# EAGLE design Power Board CRoach (EAGLE 7.1.0)
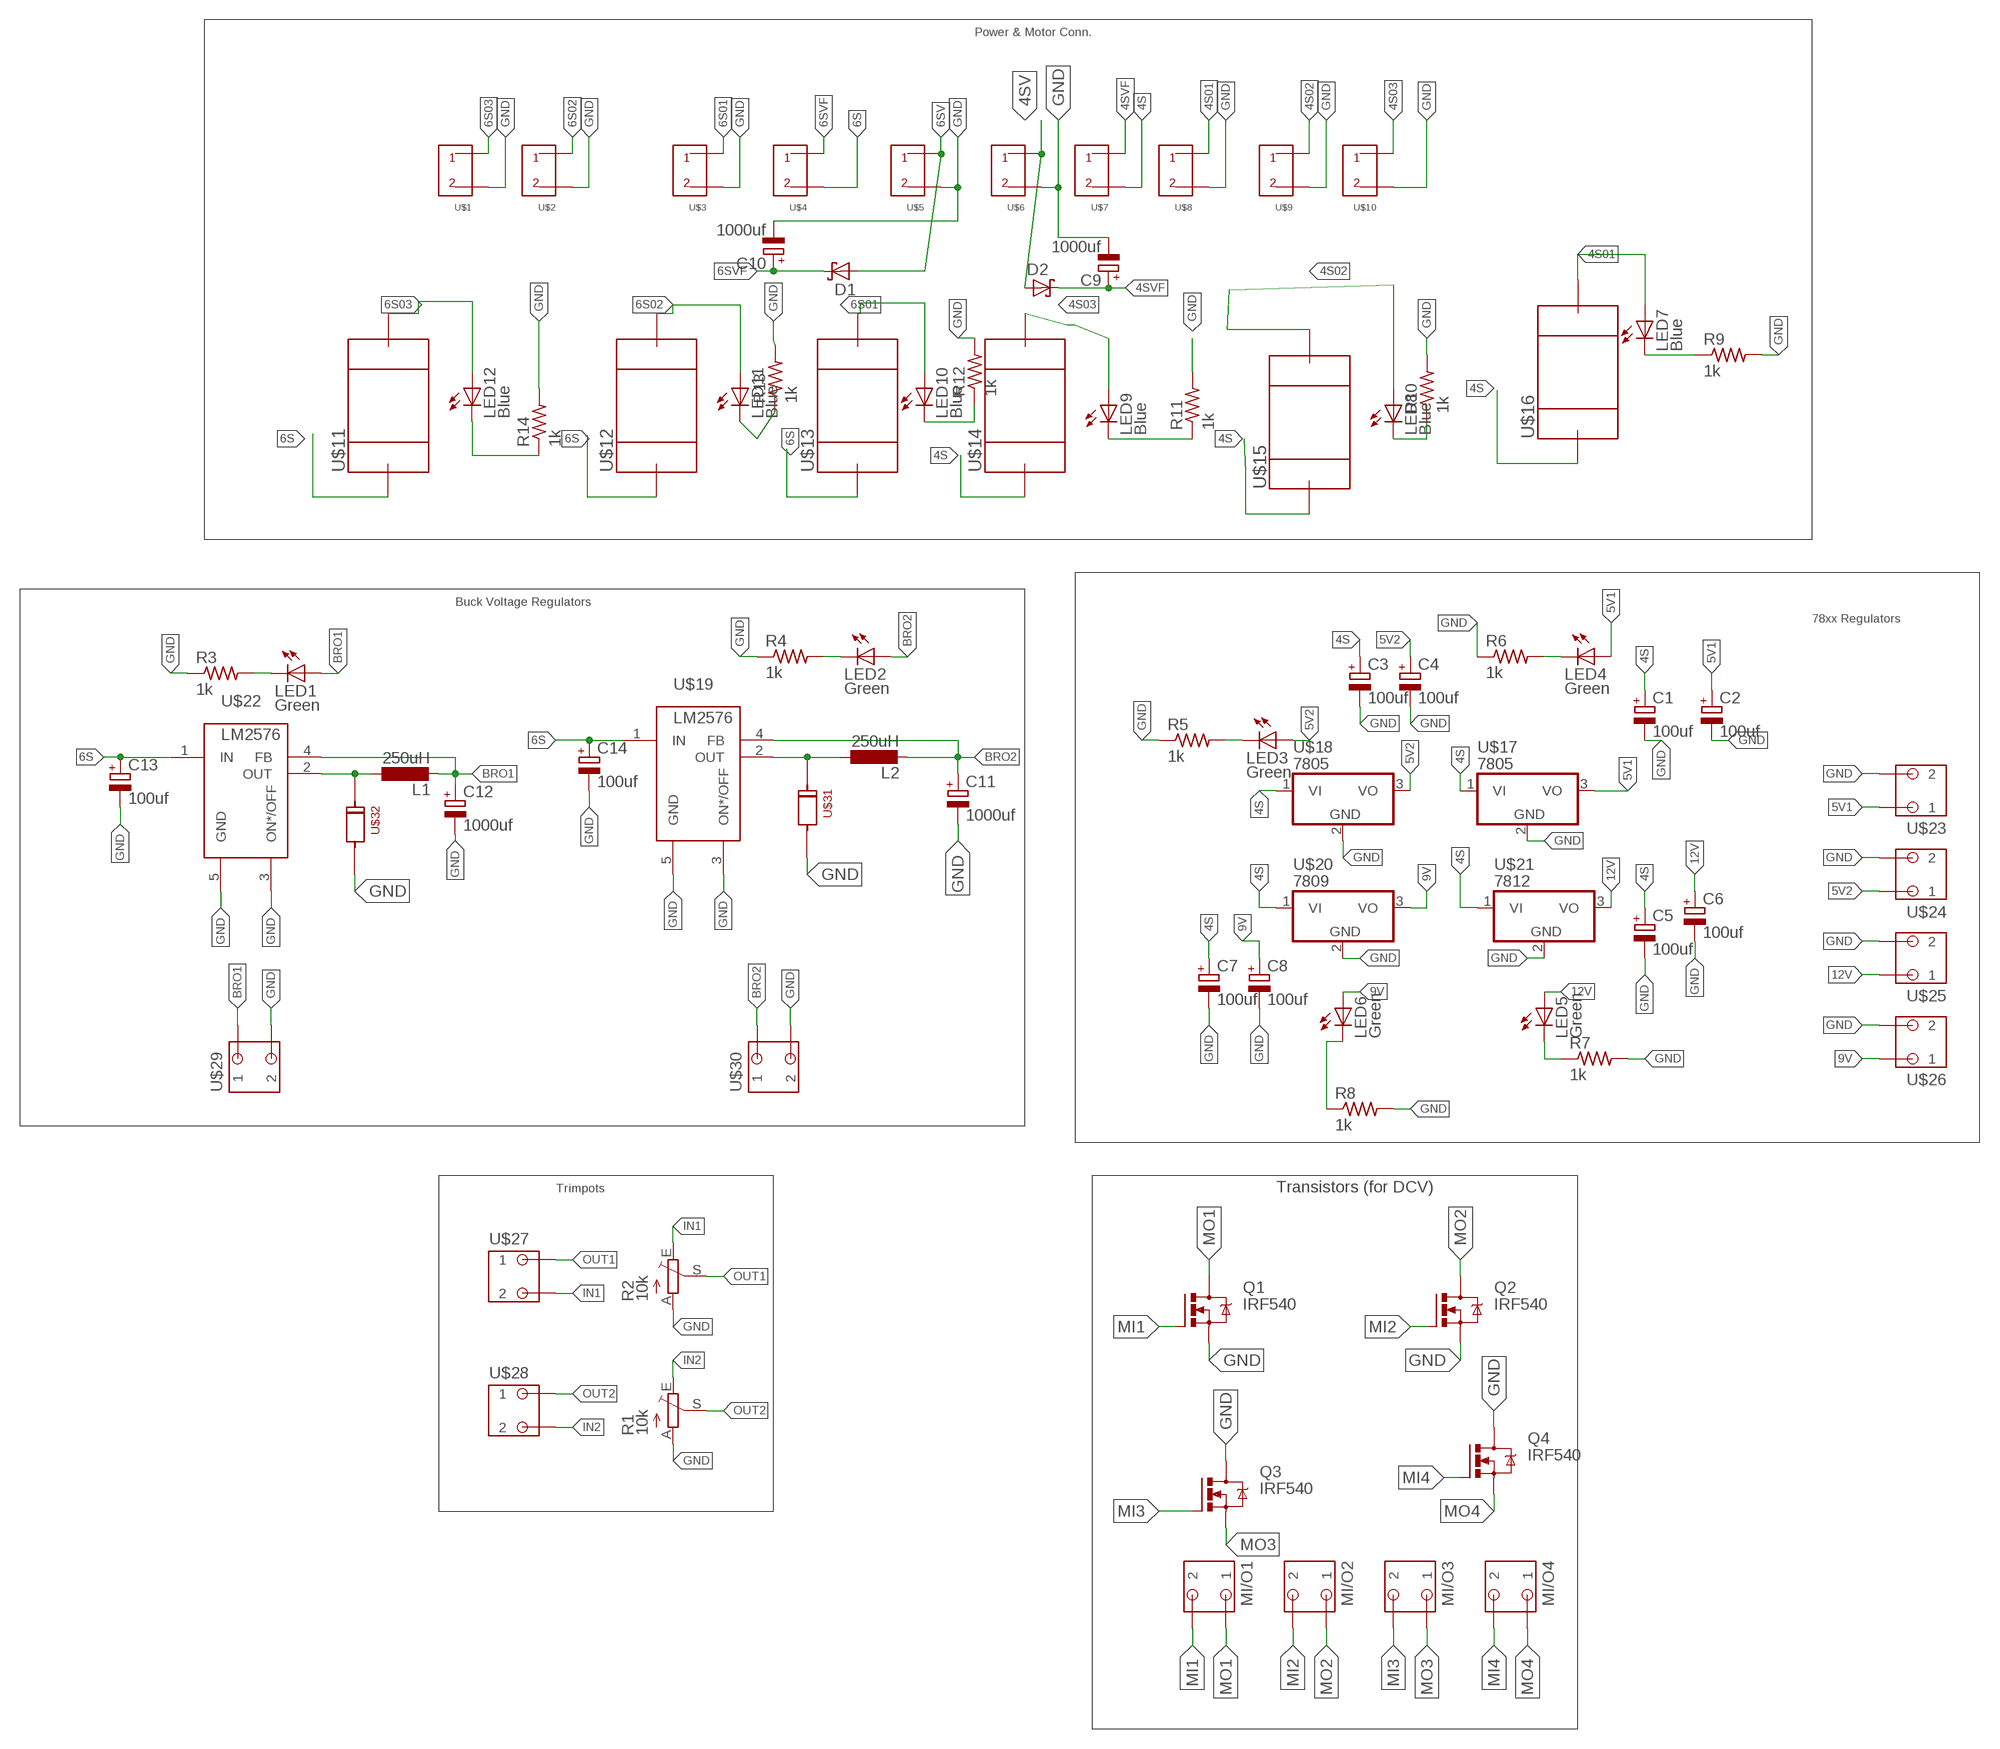
[diagram p0: schematic, sheet 1]

## Parts
C1  100uf  CPOL-EUE2-5  [E2-5]
C2  100uf  CPOL-EUE2-5  [E2-5]
C3  100uf  CPOL-EUE2-5  [E2-5]
C4  100uf  CPOL-EUE2-5  [E2-5]
C5  100uf  CPOL-EUE2-5  [E2-5]
C6  100uf  CPOL-EUE2-5  [E2-5]
C7  100uf  CPOL-EUE2-5  [E2-5]
C8  100uf  CPOL-EUE2-5  [E2-5]
C9  1000uf  CPOL-EUE7.5-16  [E7,5-16]
C10  1000uf  CPOL-EUE7.5-16  [E7,5-16]
C11  1000uf  CPOL-EUE7.5-16  [E7,5-16]
C12  1000uf  CPOL-EUE7.5-16  [E7,5-16]
C13  100uf  CPOL-EUE2.5-5  [E2,5-5]
C14  100uf  CPOL-EUE2.5-5  [E2,5-5]
D1  SCHOTTKY-DIODEP6T15  [P6T15]
D2  SCHOTTKY-DIODEP6T15  [P6T15]
L1  250uH  L-EU0204/7  [0204/7]
L2  250uH  L-EU0204/7  [0204/7]
LED1  Green  LED5MM  [LED5MM]
LED2  Green  LED5MM  [LED5MM]
LED3  Green  LED5MM  [LED5MM]
LED4  Green  LED5MM  [LED5MM]
LED5  Green  LED5MM  [LED5MM]
LED6  Green  LED5MM  [LED5MM]
LED7  Blue  LED5MM  [LED5MM]
LED8  Blue  LED5MM  [LED5MM]
LED9  Blue  LED5MM  [LED5MM]
LED10  Blue  LED5MM  [LED5MM]
LED11  Blue  LED5MM  [LED5MM]
LED12  Blue  LED5MM  [LED5MM]
MI/O1  SPTBB2-A2  [SPTB]
MI/O2  SPTBB2-A2  [SPTB]
MI/O3  SPTBB2-A2  [SPTB]
MI/O4  SPTBB2-A2  [SPTB]
Q1  IRF540  [TO220BV]
Q2  IRF540  [TO220BV]
Q3  IRF540  [TO220BV]
Q4  IRF540  [TO220BV]
R1  10k  TRIM_EU-CA6V  [CA6V]
R2  10k  TRIM_EU-CA6V  [CA6V]
R3  1k  R-US_0204/7  [0204/7]
R4  1k  R-US_0204/7  [0204/7]
R5  1k  R-US_0204/7  [0204/7]
R6  1k  R-US_0204/7  [0204/7]
R7  1k  R-US_0204/7  [0204/7]
R8  1k  R-US_0204/7  [0204/7]
R9  1k  R-US_0204/7  [0204/7]
R10  1k  R-US_0204/7  [0204/7]
R11  1k  R-US_0204/7  [0204/7]
R12  1k  R-US_0204/7  [0204/7]
R13  1k  R-US_0204/7  [0204/7]
R14  1k  R-US_0204/7  [0204/7]
U$1  SCREW_XT-60  [SCREW_XT-60]
U$2  SCREW_XT-60  [SCREW_XT-60]
U$3  SCREW_XT-60  [SCREW_XT-60]
U$4  SCREW_XT-60  [SCREW_XT-60]
U$5  SCREW_XT-60  [SCREW_XT-60]
U$6  SCREW_XT-60  [SCREW_XT-60]
U$7  SCREW_XT-60  [SCREW_XT-60]
U$8  SCREW_XT-60  [SCREW_XT-60]
U$9  SCREW_XT-60  [SCREW_XT-60]
U$10  SCREW_XT-60  [SCREW_XT-60]
U$11  CPT-FUSE  [CPT-FUSES]
U$12  CPT-FUSE  [CPT-FUSES]
U$13  CPT-FUSE  [CPT-FUSES]
U$14  CPT-FUSE  [CPT-FUSES]
U$15  CPT-FUSE  [CPT-FUSES]
U$16  CPT-FUSE  [CPT-FUSES]
U$17  7805  [78XX]
U$18  7805  [78XX]
U$19  LM2576  [LM2576]
U$20  7809  [78XX]
U$21  7812  [78XX]
U$22  LM2576  [LM2576]
U$23  SPTBB2-A1  [SPTB]
U$24  SPTBB2-A1  [SPTB]
U$25  SPTBA2-B1  [SPTB]
U$26  SPTBA2-B1  [SPTB]
U$27  SPTBB2-A1  [SPTB]
U$28  SPTBB2-A1  [SPTB]
U$29  SPTBA2-B1  [SPTB]
U$30  SPTBA2-B1  [SPTB]
U$31  1N5822  [1N5822]
U$32  1N5822  [1N5822]

## Nets
4S: C1.+ C3.+ C5.+ C7.+ U$7.P$2 U$14.P$1 U$15.P$1 U$16.P$1 U$17.1(VI) U$18.1(VI) U$20.1(VI) U$21.1(VI)
4S01: LED7.A U$8.P$1 U$16.P$2
4S02: LED8.A U$9.P$1 U$15.P$2
4S03: LED9.A U$10.P$1 U$14.P$2
4SV: D2.A U$6.P$1
4SVF: C9.+ D2.C U$7.P$1
5V1: C2.+ LED4.A U$17.3(VO) U$23.B2
5V2: C4.+ LED3.A U$18.3(VO) U$24.B2
6S: C13.+ C14.+ U$4.P$2 U$11.P$1 U$12.P$1 U$13.P$1 U$19.1(IN) U$22.1(IN)
6S01: LED10.A U$3.P$1 U$13.P$2
6S02: LED11.A U$2.P$1 U$12.P$2
6S03: LED12.A U$1.P$1 U$11.P$2
6SV: D1.A U$5.P$1
6SVF: C10.+ D1.C U$4.P$1
9V: C8.+ LED6.A U$20.3(VO) U$26.A2
12V: C6.+ LED5.A U$21.3(VO) U$25.A2
BRO1: C12.+ L1.2 LED1.A U$22.4(FB) U$29.A2
BRO2: C11.+ L2.2 LED2.A U$19.4(FB) U$30.A2
GND: C1.- C2.- C3.- C4.- C5.- C6.- C7.- C8.- C9.- C10.- C11.- C12.- C13.- C14.- Q1.S Q2.S Q3.D Q4.D R1.A R2.A R3.1 R4.1 R5.1 R6.1 R7.2 R8.2 R9.2 R10.2 R11.2 R12.2 R13.2 R14.2 U$1.P$2 U$2.P$2 U$3.P$2 U$5.P$2 U$6.P$2 U$8.P$2 U$9.P$2 U$10.P$2 U$17.2(GND) U$18.2(GND) U$19.3(ON*/OFF) U$19.5(GND) U$20.2(GND) U$21.2(GND) U$22.3(ON*/OFF) U$22.5(GND) U$23.A1 U$24.A1 U$25.B1 U$26.B1 U$29.B1 U$30.B1 U$31.- U$32.-
IN1: R2.E U$27.A1
IN2: R1.E U$28.A1
MI1: MI/O1.A2 Q1.G
MI2: MI/O2.A2 Q2.G
MI3: MI/O3.A2 Q3.G
MI4: MI/O4.A2 Q4.G
MO1: MI/O1.B2 Q1.D
MO2: MI/O2.B2 Q2.D
MO3: MI/O3.B2 Q3.S
MO4: MI/O4.B2 Q4.S
N$1: LED7.K(C) R9.1
N$2: LED8.K(C) R10.1
N$3: LED9.K(C) R11.1
N$4: LED10.K(C) R12.1
N$5: LED11.K(C) R13.1
N$6: LED12.K(C) R14.1
N$8: L1.1 U$22.2(OUT) U$32.+
N$11: L2.1 U$19.2(OUT) U$31.+
N$24: LED5.K(C) R7.1
N$25: LED6.K(C) R8.1
N$31: LED3.K(C) R5.2
N$32: LED4.K(C) R6.2
N$41: LED2.K(C) R4.2
N$42: LED1.K(C) R3.2
OUT1: R2.S U$27.B2
OUT2: R1.S U$28.B2

## Notes on the sheet
- Power & Motor Conn.
- Buck Voltage Regulators
- 78xx Regulators
- Trimpots | Transistors (for DCV)

## Library data of the parts
C1-C14 = rcl:CPOL-EU: POLARIZED CAPACITOR, European symbol
D1 D2 = diode:SCHOTTKY-DIODE: Schottky Diode
L1 L2 = rcl:L-EU: INDUCTOR, European symbol
LED1-LED12 = led:LED: LED OSRAM: - CHIPLED LG R971, LG N971, LY N971, LG Q971, LY Q971, LO R971, LY R971 LH N974, LH R974 LS Q976, LO Q976, LY Q976 LO Q996 - Hyper CHIPLED LW Q18S LB Q993, LB Q99A, LB R99A - SideLED LS A670, LO A670, LY A670, LG A670, LP A670 LB A673, LV A673, LT A673, LW A673 LH A674 LY A675 LS A676, LA A676, LO A676, LY A676, LW A676 LS A679, LY A679, LG A679 - Hyper Micro SIDELED® LS Y876, LA Y876, LO Y876, LY Y876 LT Y87S - SmartLED LW L88C, LW L88S LB L89C, LB L89S, LG L890 LS L89K, LO L89K, LY L89K LS L896, LA L896, LO L896, LY L896 - TOPLED LS T670, LO T670, LY T670, LG T670, LP T670 LSG T670, LSP T670, LSY T670, LOP T670, LYG T670 LG T671, LOG T671, LSG T671 LB T673, LV T673, LT T673, LW T673 LH T674 LS T676, LA T676, LO T676, LY T676, LB T676, LH T676, LSB T676, LW T676 LB T67C, LV T67C, LT T67C, LS T67K, LO T67K, LY T67K, LW E67C LS E67B, LA E67B, LO E67B, LY E67B, LB E67C, LV E67C, LT E67C LW T67C LS T679, LY T679, LG T679 LS T770, LO T770, LY T770, LG T770, LP T770 LB T773, LV T773, LT T773, LW T773 LH T774 LS E675, LA E675, LY E675, LS T675 LS T776, LA T776, LO T776, LY T776, LB T776 LHGB T686 LT T68C, LB T68C - Hyper Mini TOPLED® LB M676 - Mini TOPLED Santana® LG M470 LS M47K, LO M47K, LY M47K Source: http://www.osram.convergy.de LUXEON: - LUMILED® LXK2-PW12-R00, LXK2-PW12-S00, LXK2-PW14-U00, LXK2-PW14-V00 LXK2-PM12-R00, LXK2-PM12-S00, LXK2-PM14-U00 LXK2-PE12-Q00, LXK2-PE12-R00, LXK2-PE12-S00, LXK2-PE14-T00, LXK2-PE14-U00 LXK2-PB12-K00, LXK2-PB12-L00, LXK2-PB12-M00, LXK2-PB14-N00, LXK2-PB14-P00, LXK2-PB14-Q00 LXK2-PR12-L00, LXK2-PR12-M00, LXK2-PR14-Q00, LXK2-PR14-R00 LXK2-PD12-Q00, LXK2-PD12-R00, LXK2-PD12-S00 LXK2-PH12-R00, LXK2-PH12-S00 LXK2-PL12-P00, LXK2-PL12-Q00, LXK2-PL12-R00 Source: www.luxeon.com KINGBRIGHT: KA-3528ASYC Source: www.kingbright.com
MI/O1-MI/O4 U$23-U$30 = #rcn-15:SPTB
Q1-Q4 = transistor-power:IRF540: HEXFET Power MOSFET
R1 R2 = pot:TRIM_EU-: POTENTIOMETER
R3-R14 = rcl:R-US_: RESISTOR, American symbol
U$1-U$10 = #rcn-15:SCREW_XT-60
U$11-U$16 = #rcn-15:CPT-FUSE
U$17 U$18 U$20 U$21 = #rcn-15:78*: Positive VOLTAGE REGULATOR Source: http://cache.national.com/ds/LM/LM78L05.pdf http://www.fairchildsemi.com/ds/LM/LM7805.pdf
U$19 U$22 = LM2576:LM2576: LM2576 - 5V switching regulator
U$31 U$32 = #rcn-15:1N5822

## Board
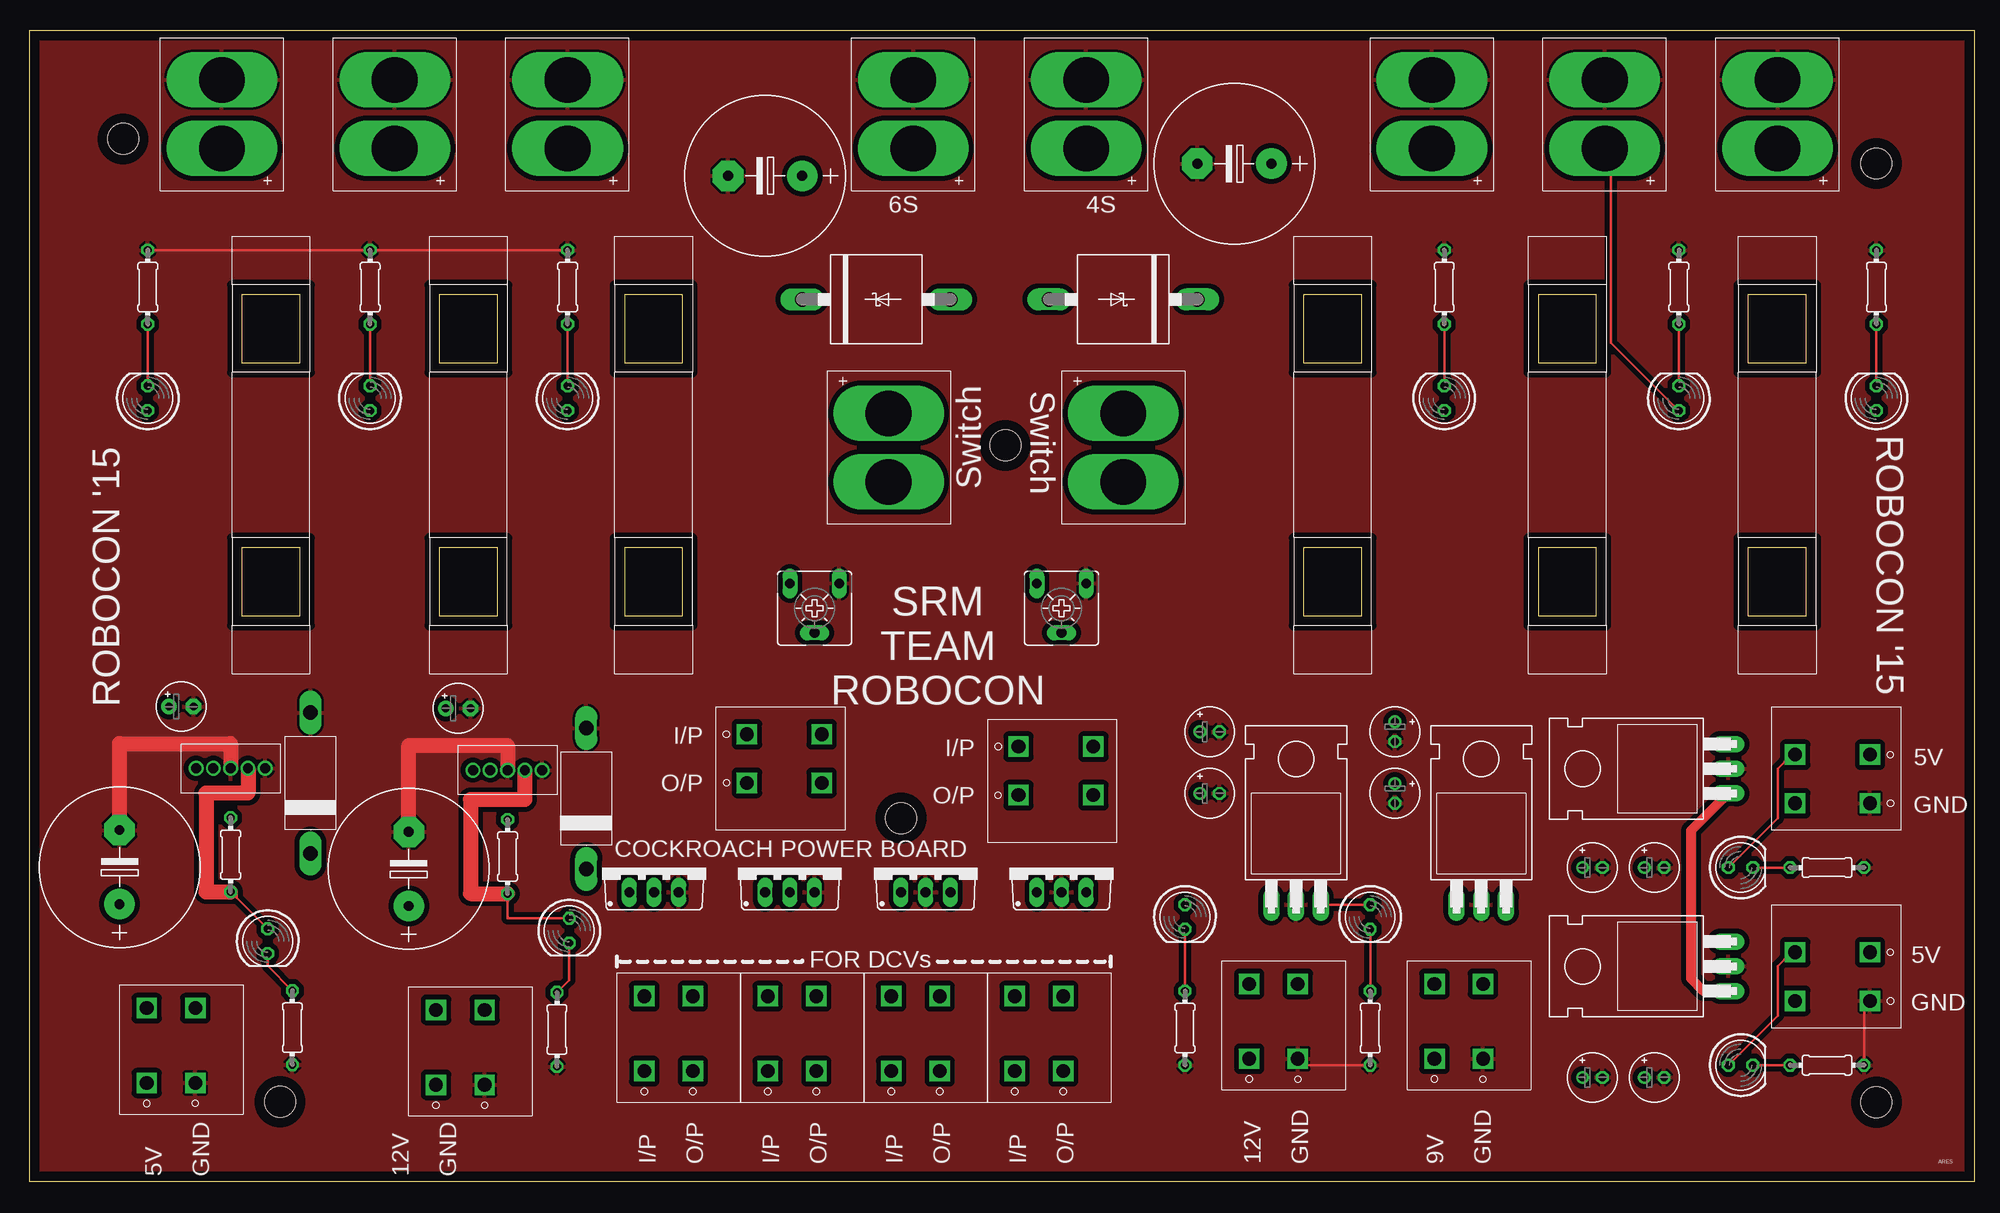
[diagram p1: board, top side]
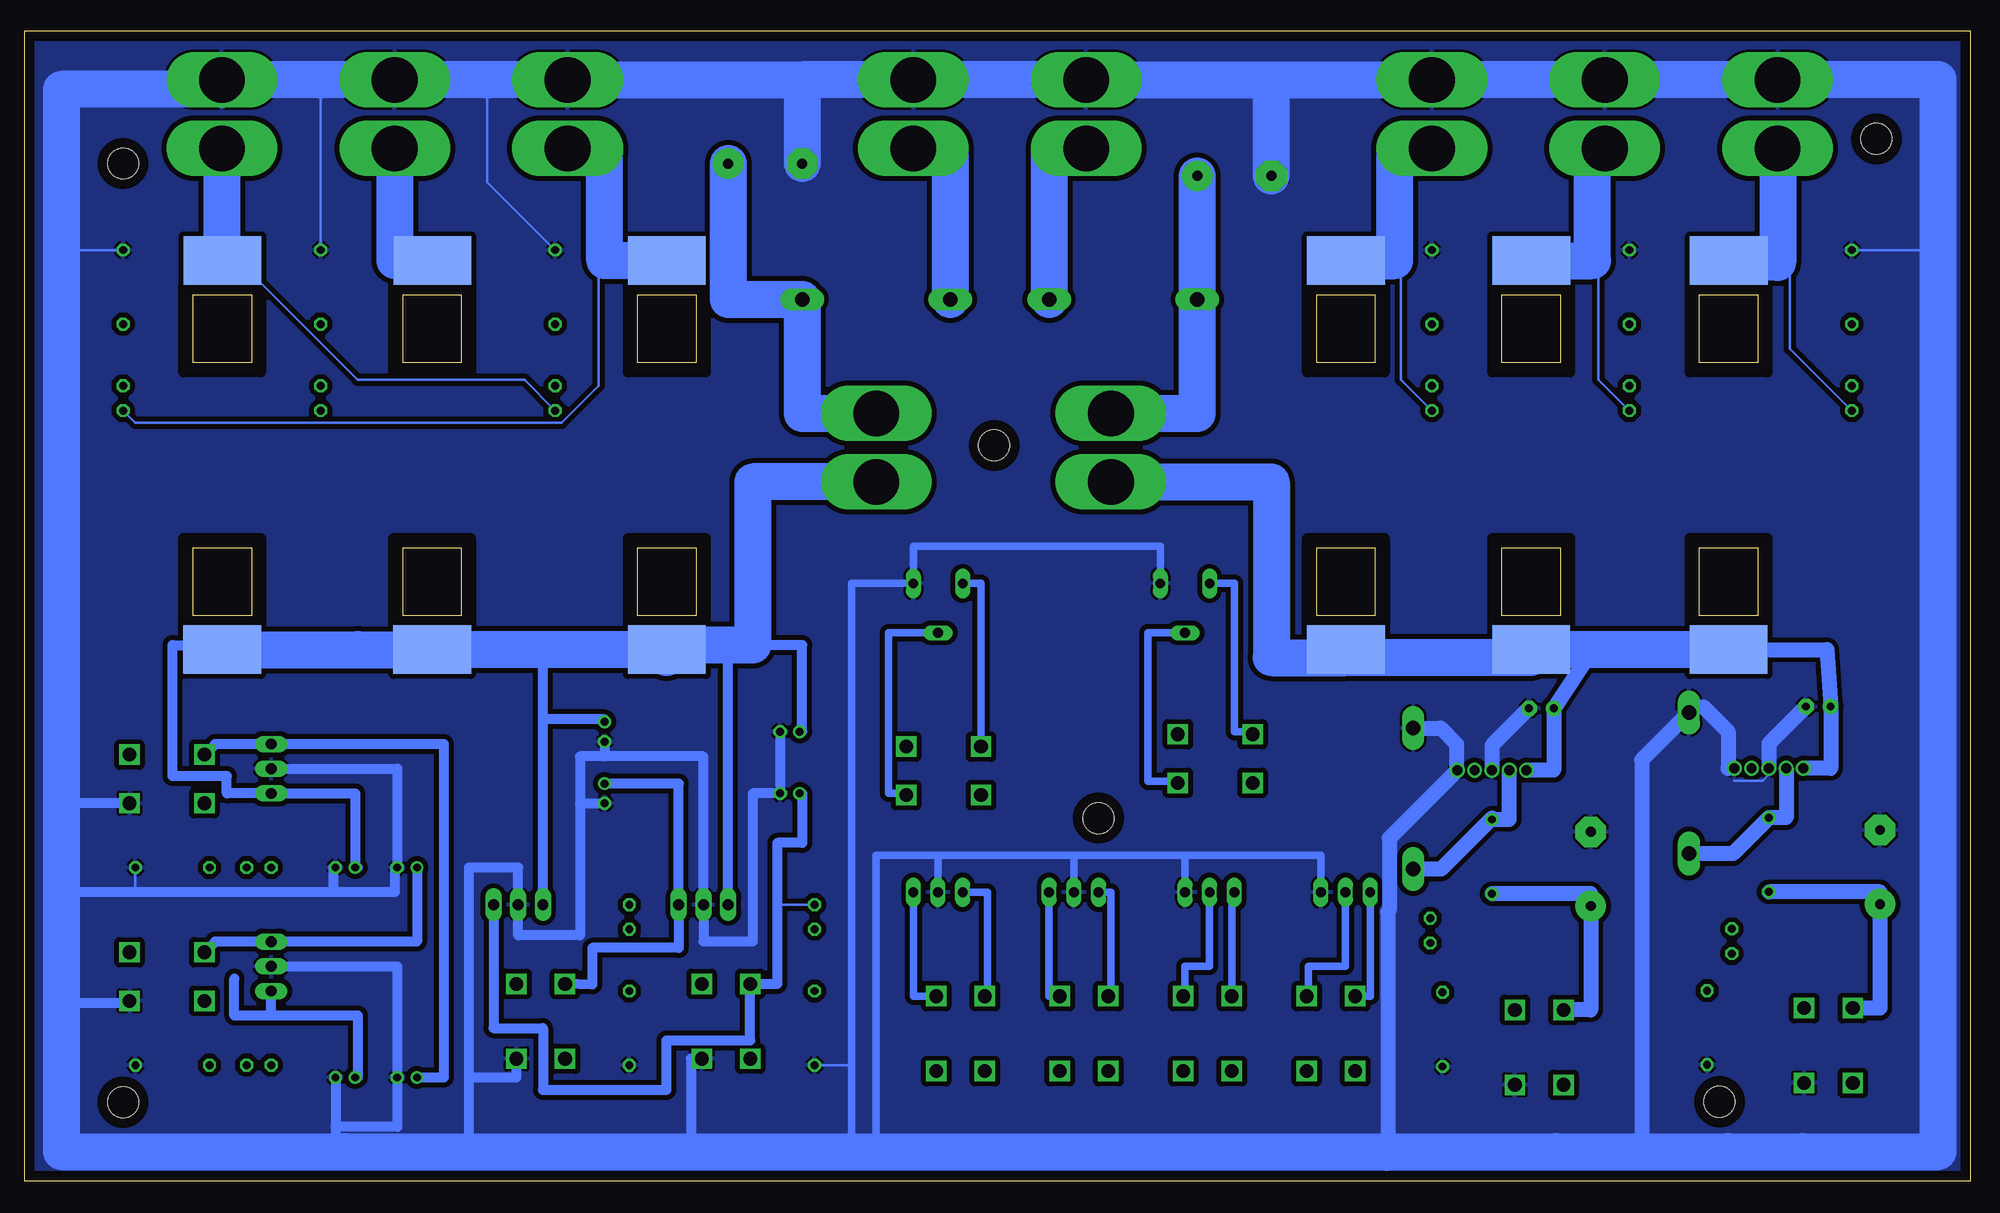
[diagram p2: board, bottom side, seen from below]

Size 200.13 x 118.29 mm. Coordinates in mm from the lower left corner, seen from the top.
Outline: 0,0 200.13,0 200.13,118.29 0,118.29 0,0
Copper layers (1*16): Top 0.035mm / dielectric 1.5mm / Bottom 0.035mm
Design rules "default *": minimum track width 10mil, minimum drill 24mil, track to track 10mil, track to pad 10mil, pad to pad 8mil, via to via 8mil, smd to smd 8mil, copper to edge 40mil, drill to drill 8mil, minimum pad ring 10mil, minimum via ring 8mil, stop-mask expansion 4mil, vias tented up to drill 0mil, thermal gap 10mil
Holes 3.17 mm at 9.65,107.19 25.8,8.17 89.66,37.34 100.4,75.67 189.99,104.65 189.99,8.13

### Footprints (pad centres in the part's own frame; a part is rotated, then mirrored left to right if it is on the bottom)
E2-5 = drill 0.813 pad 1.27: + -1.016,0 | drill 0.813 pad 1.27 octagon: - 1.016,0
E7,5-16 = drill 1.016 pad 3.15: + -3.81,0 | drill 1.016 pad 3.15 octagon: - 3.81,0
E2,5-5 = drill 0.813 pad 1.6: + -1.27,0 | drill 0.813 pad 1.6 octagon: - 1.27,0
P6T15 = drill 1.499 long: A 7.62,0; C -7.62,0
0204/7 = drill 0.813 octagon: 1 -3.81,0; 2 3.81,0
LED5MM = drill 0.813 octagon: A -1.27,0; K 1.27,0
SPTB = drill 1.4 square: A1 -2.28,-3.15; A2 -2.28,4.55; B1 2.72,-3.15; B2 2.72,4.55
TO220BV = drill 1.016 long: D 0,-2.54; G -2.54,-2.54; S 2.54,-2.54
CA6V = drill 1.016 long: A -2.54,-2.54; E 2.54,-2.54; S 0,2.54
SCREW_XT-60 = drill 4.699 long: P$1 -3.524,0; P$2 3.524,0
CPT-FUSES = smd 5 x 8 bottom: P$1 -19.492,0.039; P$2 20.502,0.055
78XX = drill 1.118 long: 1 -2.54,-8.89; 2 0,-8.89; 3 2.54,-8.89
LM2576 = drill 1.016: 1 -3.556,0; 2 -1.778,0; 3 0,0; 4 1.778,0; 5 3.556,0
1N5822 = drill 1.5 long: + -7,0; - 7.5,0

### Placement (x,y rotation side)
C1  167.13,10.67 0 top
C2  160.78,10.67 0 top
C3  167.13,32.26 0 top
C4  160.78,32.26 0 top
C5  140.46,46.23 270 top
C6  140.46,39.88 270 top
C7  121.41,46.23 0 top
C8  121.41,39.88 0 top
C9  123.95,104.65 180 top
C10  75.69,103.38 180 top
C11  39.04,32.12 90 top
C12  9.29,32.3 90 top
C13  15.64,48.81 0 top
C14  44.12,48.63 0 top
D1  87.12,90.68 0 top
D2  112.52,90.68 180 top
L1  20.72,33.57 270 top
L2  49.2,33.39 270 top
LED1  24.53,24.68 270 top
LED2  55.55,25.77 270 top
LED3  176.02,11.94 0 top
LED4  176.02,32.26 0 top
LED5  137.92,27.18 270 top
LED6  118.87,27.18 270 top
LED7  189.99,80.52 90 top
LED8  169.67,80.52 90 top
LED9  145.54,80.52 90 top
LED10  55.37,80.52 90 top
LED11  35.05,80.52 90 top
LED12  12.19,80.52 90 top
MI/O1  65.53,14.48 0 top
MI/O2  78.23,14.48 0 top
MI/O3  90.93,14.48 0 top
MI/O4  103.63,14.48 0 top
Q1  64.26,32.26 0 top
Q2  78.23,32.26 0 top
Q3  92.2,32.26 0 top
Q4  106.17,32.26 0 top
R1  80.77,58.93 180 top
R2  106.17,58.93 180 top
R3  27.07,15.79 90 top
R4  54.28,15.61 90 top
R5  184.91,11.94 180 top
R6  184.91,32.26 180 top
R7  137.92,15.75 270 top
R8  118.87,15.75 270 top
R9  189.99,91.95 90 top
R10  169.67,91.95 90 top
R11  145.54,91.95 90 top
R12  55.37,91.95 90 top
R13  35.05,91.95 90 top
R14  12.19,91.95 90 top
U$1  19.81,109.73 90 top
U$2  37.59,109.73 90 top
U$3  55.37,109.73 90 top
U$4  88.39,75.44 270 top
U$5  90.93,109.73 90 top
U$6  108.71,109.73 90 top
U$7  112.52,75.44 270 top
U$8  144.27,109.73 90 top
U$9  162.05,109.73 90 top
U$10  179.83,109.73 90 top
U$11  24.89,74.17 90 top
U$12  45.21,74.17 90 top
U$13  64.26,74.17 90 top
U$14  179.83,74.17 90 top
U$15  158.24,74.17 90 top
U$16  134.11,74.17 90 top
U$17  165.86,42.42 90 top
U$18  165.86,22.1 90 top
U$19  49.2,42.28 0 top
U$20  149.35,37.34 0 top
U$21  130.3,37.34 0 top
U$22  20.72,42.46 0 top
U$23  186.18,41.15 90 top
U$24  186.18,20.83 90 top
U$25  146.81,15.75 0 top
U$26  127.76,15.75 0 top
U$27  104.9,42.42 270 top
U$28  76.96,43.69 270 top
U$29  14.37,13.25 0 top
U$30  44.12,13.07 0 top
U$31  57.28,39.09 90 top
U$32  28.93,40.69 90 top

### Tracks (layer width: path | path; a pad name or v marks a point on that pad's centre or on a via)
4S
  Top 1.016: U$18.1 172.21,19.56 170.94,20.83 170.94,36.07 U$17.1
  Bottom 1.016: C1.+ 165.86,10.67 165.86,17.02 174.75,17.02 | 166.12,54.68 165.86,54.68 | U$20.1 146.81,47.5 | 146.81,47.5 146.81,54.68 | C5.+ 140.46,47.5 146.81,47.5 | U$21.1 127.76,55.12 | 165.86,32.26 C3.+ 166.12,39.88 U$17.1 179.32,39.88 179.32,41.66 184.91,41.66 184.91,55.12 179.79,55.12 U$14.P$1 | 174.75,17.02 178.56,17.02 178.56,20.83 | C7.+ 120.14,46.23 120.14,55.12 125.22,55.12 | 174.75,17.02 U$18.1
  Bottom 3.81: U$14.P$1 165.86,54.68 U$15.P$1 146.81,54.68 U$16.P$1 134.07,53.85 134.11,53.85 134.11,55.12 127.76,55.12 125.22,55.12 125.22,71.91 U$7.P$2
4S01
  Bottom 0.254: LED7.A 188.72,77.98 144.91,77.98 141.1,81.79 141.1,93.22 140.46,94.67
  Bottom 3.81: U$16.P$2 140.46,94.67 140.46,105.92 144.27,105.92 U$8.P$1
4S02
  Top 0.254: LED8.A 162.69,86.23 162.69,105.28 162.05,105.92 U$9.P$1
  Bottom 3.81: U$9.P$1 162.05,94.67 U$15.P$2
4S03
  Bottom 0.254: LED9.A 148.72,82.42 165.86,82.42 177.93,94.49 U$14.P$2
  Bottom 3.81: U$10.P$1 179.83,94.67 U$14.P$2
4SV
  Bottom 3.81: D2.A 104.9,106.2 U$6.P$1
4SVF
  Bottom 3.81: C9.+ 127.76,90.68 D2.C 120.14,78.96 U$7.P$1
5V1
  Top 0.254: LED4.A 179.83,37.34 179.83,42.42 181.1,43.69 U$23.B2
  Bottom 1.016: C2.+ 156.97,10.67 156.97,44.96 U$17.3 180.54,44.96 U$23.B2
5V2
  Top 0.254: LED3.A 179.83,17.02 179.83,22.1 181.1,23.37 U$24.B2
  Bottom 1.016: C4.+ 159.77,24.64 U$18.3 180.54,24.64 U$24.B2
6S
  Bottom 0.61: 64.26,53.85 64.26,52.58
  Bottom 1.524: 38.86,54.68 C14.+ 42.85,42.28 U$19.1 | U$11.P$1 14.73,54.68 C13.+ 14.37,42.46 U$22.1 | U$13.P$1 64.26,54.68 64.26,53.85
  Bottom 3.81: U$11.P$1 38.86,54.68 U$12.P$1 45.21,54.68 45.21,53.85 64.26,53.85 71.88,53.85 71.88,71.91 U$4.P$2
6S01
  Bottom 0.254: LED10.A 58.55,82.42 58.55,93.22 59.18,94.67
  Bottom 3.81: U$13.P$2 59.18,94.67 59.18,105.92 55.37,105.92 U$3.P$1
6S02
  Bottom 0.254: LED11.A 38.23,82.42 38.23,93.22 38.86,94.67
  Bottom 3.81: U$12.P$2 38.86,94.67 38.86,105.92 37.59,105.92 U$2.P$1
6S03
  Bottom 0.254: LED12.A 18.54,85.6 18.54,93.22 19.81,94.49
  Bottom 3.81: U$1.P$1 19.81,94.49 24.84,94.49 U$11.P$2
6SV
  Bottom 3.81: U$5.P$1 94.74,106.2 D1.A
6SVF
  Bottom 3.81: U$4.P$1 79.5,78.96 D1.C C10.+
9V
  Bottom 0.254: 122.68,28.45 LED6.A
  Bottom 1.016: C8.+ 120.14,39.88 120.14,34.8 122.68,34.8 122.68,28.45 122.68,20.3 U$26.A2 125.48,14.48 134.11,14.48 134.11,9.4 146.81,9.4 146.81,15.75 151.89,15.75 U$20.3
12V
  Top 0.254: U$21.3 LED5.A
  Bottom 1.016: C6.+ 132.84,40.89 U$21.3 132.84,24 141.73,24 141.73,20.22 U$25.A2
BRO1
  Top 0.254: LED1.A 21.35,29.13 21.35,29.76 L1.2
  Top 1.524: U$22.4 22.49,39.92 18.18,39.92 18.18,29.76 L1.2
  Bottom 1.524: U$29.A2 9.29,17.8 C12.+ 9.29,29.76 L1.2
BRO2
  Top 0.254: LED2.A 49.2,27.04 L2.2
  Top 1.524: U$19.4 50.97,39.23 45.39,39.23 45.39,29.58 L2.2
  Bottom 1.524: U$30.A2 39.04,17.62 C11.+ 39.04,29.58 L2.2
GND
  Top 0.254: R12.2 R13.2 R14.2 | R7.2 130.94,11.94 130.94,12.57 U$26.B1 | R5.1 188.72,18.29 U$24.A1
  Top 1.524: C11.- 39.04,44.82 49.2,44.82 U$19.3 | C12.- 9.29,45 20.72,45 U$22.3
  Bottom 0.254: 3.3,95.76 R14.2 | 115.06,11.94 R8.2 | 188.72,29.72 R6.1 | R11.2 152.53,102.74 152.53,113.25 | 169.67,113.25 R10.2 | 196.34,95.76 R9.2 | 24.27,41.19 21.35,41.19 20.72,41.83 U$22.3
  Bottom 0.762: Q4.D 106.17,33.53 | 106.17,33.53 112.52,33.53 112.52,3.05 | Q3.D 92.2,33.53 | 92.2,33.53 106.17,33.53 | 80.77,33.53 92.2,33.53 | R1.A 83.31,65.28 108.71,65.28 R2.A 115.06,61.47 115.06,11.94 115.06,3.05 | Q1.S 66.8,33.53 80.77,33.53 | Q2.S 80.77,33.53
  Bottom 1.016: C1.- 168.15,5.59 | 168.15,5.59 168.15,3.05 167.13,3.05 | 168.15,5.59 161.8,5.59 C2.- 161.8,22.1 U$18.2 | 154.43,10.67 149.53,10.67 U$25.B1 | C5.- 140.46,43.69 | 140.46,43.69 143,43.69 143,38.86 | 143,38.86 C6.- | 154.43,10.67 154.43,32.26 149.35,32.26 U$20.2 149.35,25.27 143,25.27 143,38.86 | U$24.A1 189.33,18.29 196.34,18.29 | C3.- 168.4,32.26 168.4,29.72 | U$17.2 161.8,42.42 C4.- 162.05,32.26 162.05,29.72 168.4,29.72 | C7.- C8.- 125.22,39.88 125.22,24.64 130.3,24.64 U$21.2 130.3,43.69 140.46,43.69 | U$23.A1 196.34,38.87 196.34,38.61 | 168.4,29.72 188.72,29.72 196.34,29.72 | 154.43,10.67 154.43,3.05 | U$26.B1 131.57,12.6 131.57,3.05
  Bottom 1.524: C13.- 20.72,45 U$22.3 | C14.- 49.2,44.82 U$19.3 | 25.07,3.05 24.89,3.05 | 17.45,3.05 17.27,3.05 | 42.85,3.05 42.67,3.05 | U$22.5 24.89,42.46 24.89,46.23 27.43,48.77 28.7,48.77 28.7,47.5 | U$31.- 54.46,46.59 52.83,44.96 52.83,42.36 U$19.5 59.75,35.27 59.75,27.86 59.92,27.69 59.92,2.39 60.03,2.28 | U$32.- 33.78,43.33 33.78,3.05 | 60.03,2.28 60.03,1.84 | 60.03,2.28 60.03,3.05
  Bottom 3.81: U$1.P$2 U$2.P$2 U$3.P$2 71.88,113.25 | U$5.P$2 90.93,113.54 | U$6.P$2 108.71,113.54 | 144.27,113.54 U$8.P$2 | U$8.P$2 152.53,113.25 U$9.P$2 169.67,113.25 U$10.P$2 179.83,112.27 196.34,112.27 196.34,95.76 196.34,38.61 196.34,29.72 196.34,18.29 196.34,3.05 167.13,3.05 154.43,3.05 131.57,3.05 115.06,3.05 112.52,3.05 60.03,3.05 42.67,3.05 33.78,3.05 24.89,3.05 17.27,3.05 3.3,3.05 3.3,95.76 3.3,113.28 21.08,113.28 | C10.- 71.88,113.25 | U$5.P$2 71.88,113.25 | U$6.P$2 120.14,113.25 | 120.14,113.25 C9.- | U$8.P$2 120.14,113.25 | U$5.P$2 U$6.P$2
  pour Bottom (isolate 0.508): 0.02,118.29 200.13,118.29 200.13,103.38 200.13,103.38 200.13,0 0,0 0,2.2 0.02,2.2 0.02,118.26
  pour Top (isolate 0.508): 0,118.29 200.13,118.29 200.13,112.27 200.14,112.27 200.14,0 0,0 0,2.08 0,2.08
IN1
  Bottom 0.762: R2.E 101.75,61.47 U$27.A1
IN2
  Bottom 0.762: R1.E 75.69,61.47 75.69,46.23 73.81,46.23 U$28.A1
MI1
  Bottom 0.762: Q1.G 61.72,19.03 MI/O1.A2
MI2
  Bottom 0.762: MI/O2.A2 75.95,29.72 Q2.G
MI3
  Bottom 0.762: Q3.G 88.39,29.72 88.39,19.03 MI/O3.A2
MI4
  Bottom 0.762: Q4.G 101.09,29.72 101.09,19.03 MI/O4.A2
MO1
  Bottom 0.762: Q1.D 64.26,22.1 68.07,22.1 68.07,19.03 MI/O1.B2
MO2
  Bottom 0.762: Q2.D 78.23,22.1 80.77,22.1 80.77,19.03 MI/O2.B2
MO3
  Bottom 0.762: Q3.S 94.74,19.03 MI/O3.B2
MO4
  Bottom 0.762: Q4.S 108.71,19.03 MI/O4.B2
N$1
  Top 0.254: R9.1 LED7.K
N$2
  Top 0.254: R10.1 LED8.K
N$3
  Top 0.254: R11.1 LED9.K
N$4
  Top 0.254: R12.1 LED10.K
N$5
  Top 0.254: R13.1 LED11.K
N$6
  Top 0.254: R14.1 LED12.K
N$8
  Bottom 1.524: U$22.2 18.94,37.38 L1.1 24.41,33.69 U$32.+ 28.93,32.3
N$11
  Bottom 1.524: U$19.2 47.42,37.2 L2.1 49.2,37.34 54.44,32.09 U$31.+
N$24
  Top 0.254: LED5.K R7.1
N$25
  Top 0.254: LED6.K R8.1
N$31
  Top 0.254: R5.2 LED3.K
N$32
  Top 0.254: R6.2 LED4.K
N$41
  Top 0.254: R4.2 55.55,20.69 LED2.K
N$42
  Top 0.254: R3.2 24.53,22.14 LED1.K
OUT1
  Bottom 0.762: R2.S 111.25,56.39 111.25,39.88 109.45,39.88 U$27.B2
OUT2
  Bottom 0.762: R1.S 84.58,56.39 84.58,41.15 81.51,41.15 U$28.B2

### Text on the board
tNames: 6S | 4S | Switch | Switch | ROBOCON '15 | SRM / TEAM / ROBOCON | ROBOCON '15 | I/P / O/P | I/P / O/P | 5V / GND | COCKROACH POWER BOARD | FOR DCVs | 5V / GND | I/P / O/P | I/P / O/P | I/P / O/P | I/P / O/P | 12V / GND | 9V / GND | ARES | 5V / GND | 12V / GND